# Altium schematic sheet ThermistorSim.SchDoc
size A
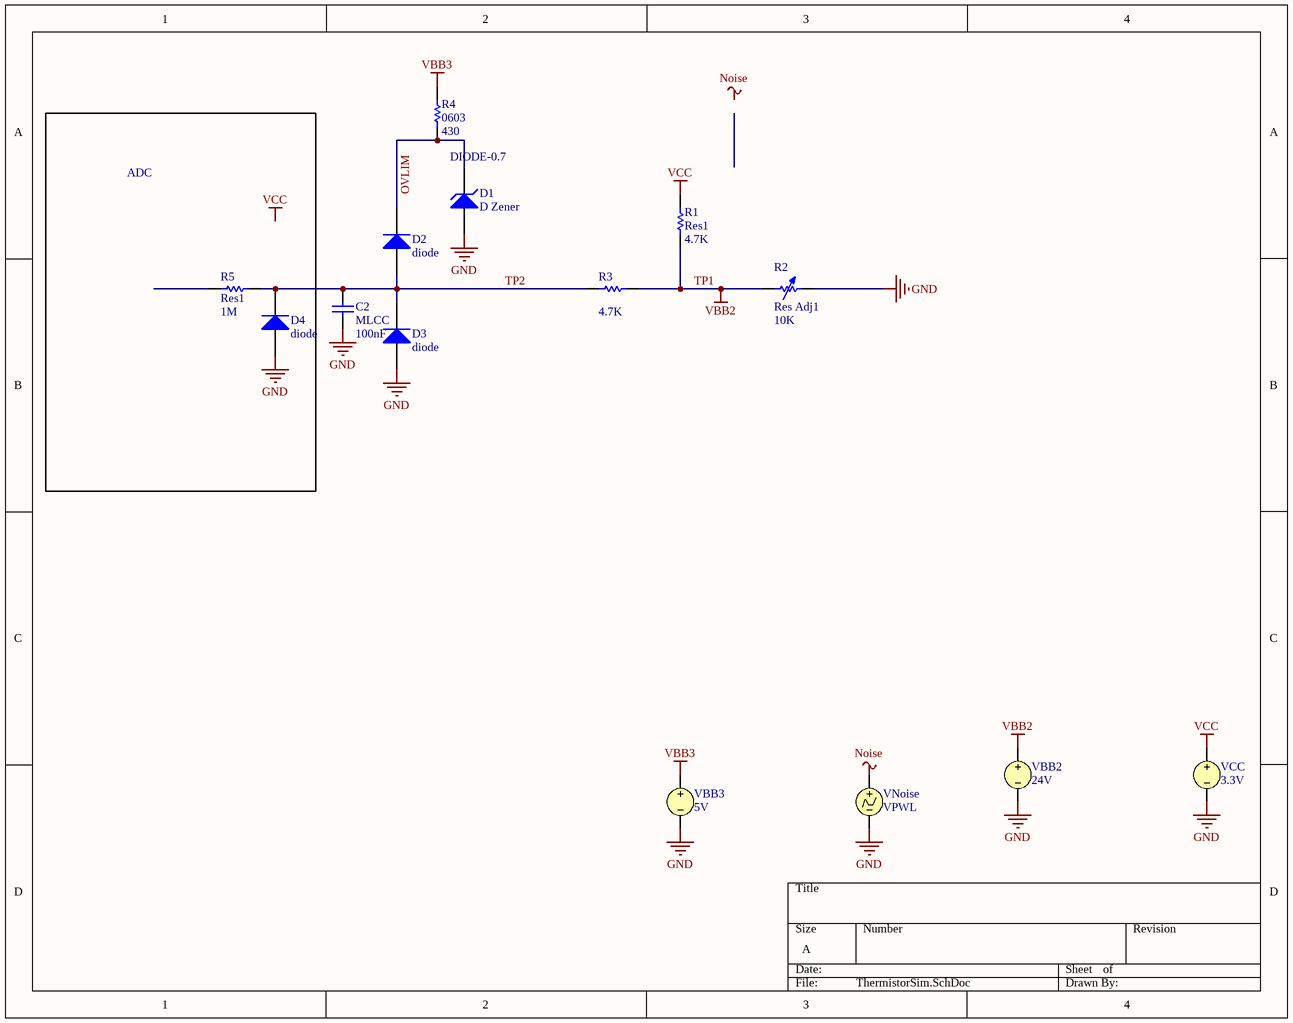
[diagram p0: ThermistorSim.SchDoc]

## Parts
C2  MLCC  value 100nF  [RAD-0.3]
D1  D Zener  [DIODE-0.7]
D2  diode  [SMC]
D3  diode  [SMC]
D4  diode  [SMC]
R1  Res1  value 4.7K  [AXIAL-0.3]
R2  Res Adj1  value 10K  [AXIAL-0.7]
R3  value 4.7K  [AXIAL-0.3]
R4  0603  value 430  [AXIAL-0.3]
R5  Res1  value 1M  [AXIAL-0.3]
VBB2  24V
VBB3  5V
VCC  3.3V
VNoise  VPWL

## Blocks framed on the sheet
ADC: D4 R5

## Nets
GND: C2.1 D1.1(A) D3.1(A) D4.1(A) R2.2 VBB2.2 VBB3.2 VCC.2 VNoise.2
Noise: VNoise.1
TP1: R1.1 R2.1 R3.2 VBB2.1  [also labelled VBB2]
VBB3: R4.2 VBB3.1
VCC: R1.2 VCC.1
OVLIM: D1.2(K) D2.2(K) R4.1
TP2: C2.2 D2.1(A) D3.2(K) D4.2(K) R3.1 R5.1

Not connected (* = marked no-connect by the designer): R5 2

## Notes on the sheet
- Labels drawn without touching a wire or pin: Noise, VCC

## Library data of the parts
C2 = Cap: Capacitor; Published: 8-Jun-2000; LatestRevisionDate: 17-Jul-2002; LatestRevisionNote: Re-released for DXP Platform.; PackageReference: RAD-0.3; Publisher: Altium Limited; PackageDescription: Radial Cap, Thru-Hole; 2 Leads; 0.3 in Pin Spacing
D1 = D Zener: Zener Diode; Published: 8-Jun-2000; LatestRevisionDate: 17-Jul-2002; LatestRevisionNote: Re-released for DXP Platform.; PackageReference: DIODE-0.7; Publisher: Altium Limited; PackageDescription: Diode, Thru-Hole; 2 Leads; 0.7 in Pin Spacing
D2-D4 = diode: Default Diode; Published: 8-Jun-2000; LatestRevisionDate: 17-Jul-2002; LatestRevisionNote: Re-released for DXP Platform.; PackageVersion: Sep-1996; PackageReference: SMC; Publisher: Altium Limited; PackageDescription: DO-214-AB/SMC; 2 C-Bend Leads; Body 7.9 x 5.9 mm, inc. leads (LxW); Code_JEDEC: DO-214-AB
R1 R3-R5 = Res1: Resistor; Published: 8-Jun-2000; LatestRevisionDate: 17-Jul-2002; LatestRevisionNote: Re-released for DXP Platform.; PackageReference: AXIAL-0.3; Publisher: Altium Limited; PackageDescription: Axial Device, Thru-Hole; 2 Leads; 0.3 in Pin Spacing
R2 = Res Adj1: Variable Resistor; Set Position: .08; Published: 8-Jun-2000; LatestRevisionDate: 17-Jul-2002; LatestRevisionNote: Re-released for DXP Platform.; PackageReference: AXIAL-0.7; Publisher: Altium Limited; PackageDescription: Axial Device, Thru-Hole; 2 Leads; 0.7 in Pin Spacing
VBB2 VBB3 VCC = VSRC: Voltage Source; Note: PCB Footprint - Not required; Published: 8-Jun-2000; LatestRevisionDate: 17-Jul-2002; LatestRevisionNote: Re-released for DXP Platform.; PackageReference: Not Applicable; Publisher: Altium Limited
  VBB2: Value: 24V
  VBB3: Value: 5V
  VCC: Value: 3.3V
VNoise = VPWL: Piecewise Linear Voltage Source; Note: PCB Footprint - Not required; Sim Note: To add model file containing time-current pairs of values, enter model location under "General Tab" in "Full Path" box.; Published: 8-Jun-2000; LatestRevisionDate: 17-Jul-2002; LatestRevisionNote: Re-released for DXP Platform.; PackageReference: Not Applicable; Publisher: Altium Limited